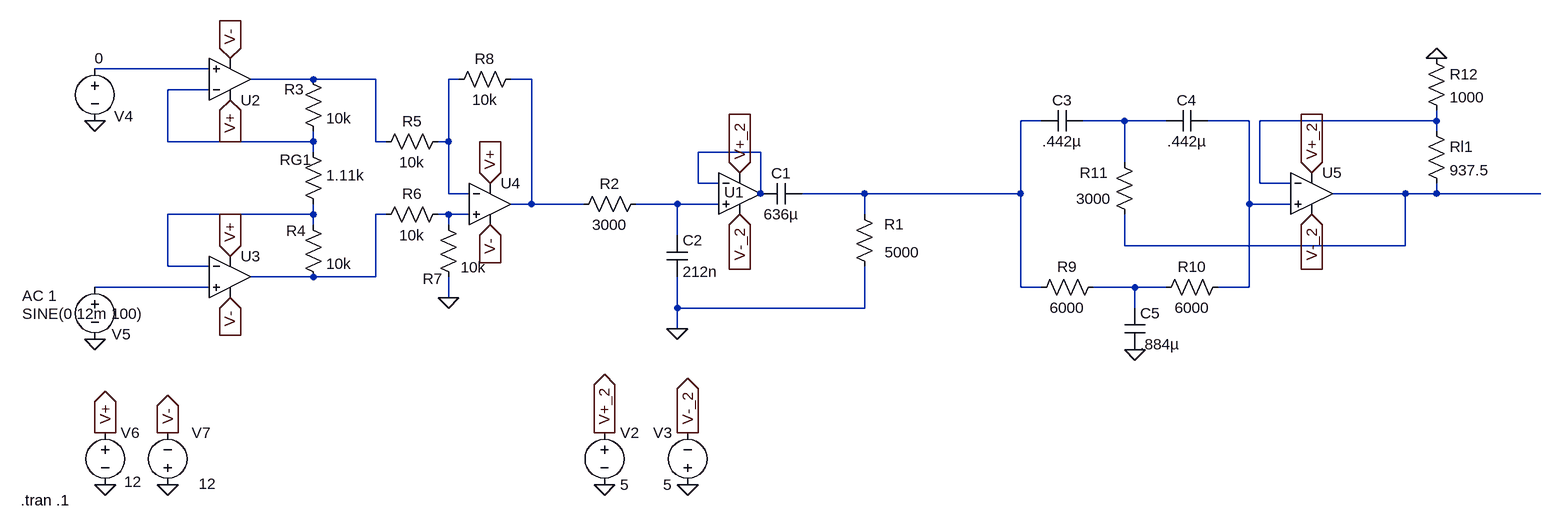
[diagram p0: schematic Full Circuit fr.asc]
Full Circuit fr.asc, the LTspice schematic file:
Version 4
SHEET 1 1400 680
WIRE -848 -64 -1024 -64
WIRE -688 -48 -784 -48
WIRE -592 -48 -688 -48
WIRE -464 -48 -480 -48
WIRE -352 -48 -384 -48
WIRE -848 -32 -912 -32
WIRE 432 16 400 16
WIRE 560 16 496 16
WIRE 624 16 560 16
WIRE 752 16 688 16
WIRE 1040 16 1040 0
WIRE 1040 16 768 16
WIRE 1040 32 1040 16
WIRE -912 48 -912 -32
WIRE -688 48 -688 32
WIRE -688 48 -912 48
WIRE -592 48 -592 -48
WIRE -576 48 -592 48
WIRE -480 48 -480 -48
WIRE -480 48 -496 48
WIRE -688 64 -688 48
WIRE 0 64 -96 64
WIRE 560 80 560 16
WIRE -96 112 -96 64
WIRE -64 112 -96 112
WIRE 768 112 768 16
WIRE 816 112 768 112
WIRE -480 128 -480 48
WIRE -448 128 -480 128
WIRE 0 128 0 64
WIRE 160 128 64 128
WIRE 400 128 400 16
WIRE 400 128 160 128
WIRE 992 128 880 128
WIRE 1040 128 1040 112
WIRE 1040 128 992 128
WIRE 1200 128 1040 128
WIRE -352 144 -352 -48
WIRE -352 144 -384 144
WIRE -272 144 -352 144
WIRE -128 144 -192 144
WIRE -64 144 -128 144
WIRE 752 144 752 16
WIRE 816 144 752 144
WIRE -688 160 -688 144
WIRE -688 160 -912 160
WIRE -576 160 -592 160
WIRE -480 160 -496 160
WIRE -448 160 -480 160
WIRE 160 160 160 128
WIRE -688 176 -688 160
WIRE -480 176 -480 160
WIRE -128 192 -128 144
WIRE 560 208 560 160
WIRE 992 208 992 128
WIRE 992 208 560 208
WIRE -912 240 -912 160
WIRE -848 240 -912 240
WIRE -688 256 -784 256
WIRE -592 256 -592 160
WIRE -592 256 -688 256
WIRE -848 272 -1024 272
WIRE 400 272 400 128
WIRE 432 272 400 272
WIRE 576 272 512 272
WIRE 624 272 576 272
WIRE 752 272 752 144
WIRE 752 272 704 272
WIRE -480 288 -480 256
WIRE -128 304 -128 256
WIRE 160 304 160 240
WIRE 160 304 -128 304
WIRE 576 304 576 272
WIRE -128 336 -128 304
FLAG -128 336 0
FLAG -240 496 V+_2
IOPIN -240 496 Out
FLAG -112 496 V-_2
IOPIN -112 496 Out
FLAG -240 576 0
FLAG -112 576 0
FLAG -32 96 V+_2
IOPIN -32 96 In
FLAG -32 160 V-_2
IOPIN -32 160 In
FLAG -480 288 0
FLAG -1024 16 0
FLAG -1024 352 0
FLAG -816 -80 V-
IOPIN -816 -80 In
FLAG -816 -16 V+
IOPIN -816 -16 In
FLAG -816 224 V+
IOPIN -816 224 In
FLAG -816 288 V-
IOPIN -816 288 In
FLAG -416 112 V+
IOPIN -416 112 In
FLAG -416 176 V-
IOPIN -416 176 In
FLAG -1008 576 0
FLAG -912 576 0
FLAG -1008 496 V+
IOPIN -1008 496 Out
FLAG -912 496 V-
IOPIN -912 496 Out
FLAG 848 96 V+_2
IOPIN 848 96 In
FLAG 848 160 V-_2
IOPIN 848 160 In
FLAG 576 368 0
FLAG 1040 -80 0
SYMBOL cap 0 144 R270
WINDOW 0 32 32 VTop 2
WINDOW 3 0 32 VBottom 2
SYMATTR InstName C1
SYMATTR Value 636µ
SYMBOL cap -144 192 R0
SYMATTR InstName C2
SYMATTR Value 212n
SYMBOL res 176 256 R180
WINDOW 0 -45 81 Left 2
WINDOW 3 -69 38 Left 2
SYMATTR InstName R1
SYMATTR Value 5000
SYMBOL res -288 160 R270
WINDOW 0 32 56 VTop 2
WINDOW 3 0 56 VBottom 2
SYMATTR InstName R2
SYMATTR Value 3000
SYMBOL OpAmps\\UniversalOpamp2 -32 128 R0
WINDOW 0 -24 -2 Left 2
SYMATTR InstName U1
SYMBOL voltage -240 480 R0
WINDOW 123 0 0 Left 0
WINDOW 39 0 0 Left 0
SYMATTR InstName V2
SYMATTR Value 5
SYMBOL voltage -112 592 R180
WINDOW 0 24 96 Left 2
WINDOW 3 24 16 Left 2
WINDOW 123 0 0 Left 0
WINDOW 39 0 0 Left 0
SYMATTR InstName V3
SYMATTR Value 5
SYMBOL OpAmps\\UniversalOpamp2 -816 -48 M180
SYMATTR InstName U2
SYMBOL OpAmps\\UniversalOpamp2 -816 256 R0
SYMATTR InstName U3
SYMBOL res -704 -64 R0
WINDOW 0 -29 31 Left 2
SYMATTR InstName R3
SYMATTR Value 10k
SYMBOL res -704 48 R0
WINDOW 0 -36 28 Left 2
WINDOW 3 36 52 Left 2
SYMATTR InstName RG1
SYMATTR Value 1.11k
SYMBOL res -704 160 R0
WINDOW 0 -26 25 Left 2
SYMATTR InstName R4
SYMATTR Value 10k
SYMBOL OpAmps\\UniversalOpamp2 -416 144 R0
SYMATTR InstName U4
SYMBOL res -480 32 R90
WINDOW 0 0 56 VBottom 2
WINDOW 3 32 56 VTop 2
SYMATTR InstName R5
SYMATTR Value 10k
SYMBOL res -480 144 R90
WINDOW 0 0 56 VBottom 2
WINDOW 3 32 56 VTop 2
SYMATTR InstName R6
SYMATTR Value 10k
SYMBOL res -496 160 R0
WINDOW 0 -24 99 Left 2
WINDOW 3 35 81 Left 2
SYMATTR InstName R7
SYMATTR Value 10k
SYMBOL res -368 -64 R90
WINDOW 0 0 56 VBottom 2
WINDOW 3 32 56 VTop 2
SYMATTR InstName R8
SYMATTR Value 10k
SYMBOL voltage -1024 -80 R0
WINDOW 0 30 89 Left 2
WINDOW 3 0 0 Left 2
WINDOW 123 0 0 Left 0
WINDOW 39 0 0 Left 0
SYMATTR InstName V4
SYMATTR Value 0
SYMBOL voltage -1024 256 R0
WINDOW 0 26 88 Left 2
WINDOW 3 -112 57 Left 2
WINDOW 123 -112 29 Left 2
WINDOW 39 0 0 Left 0
SYMATTR InstName V5
SYMATTR Value SINE(0 12m 100)
SYMATTR Value2 AC 1
SYMBOL voltage -1008 480 R0
WINDOW 3 29 91 Left 2
WINDOW 123 0 0 Left 0
WINDOW 39 0 0 Left 0
SYMATTR Value 12
SYMATTR InstName V6
SYMBOL voltage -912 592 R180
WINDOW 0 -66 96 Left 2
WINDOW 3 -75 18 Left 2
WINDOW 123 0 0 Left 0
WINDOW 39 0 0 Left 0
SYMATTR InstName V7
SYMATTR Value 12
SYMBOL res 528 256 R90
WINDOW 0 0 56 VBottom 2
WINDOW 3 32 56 VTop 2
SYMATTR InstName R9
SYMATTR Value 6000
SYMBOL res 720 256 R90
WINDOW 0 0 56 VBottom 2
WINDOW 3 32 56 VTop 2
SYMATTR InstName R10
SYMATTR Value 6000
SYMBOL cap 496 0 R90
WINDOW 0 0 32 VBottom 2
WINDOW 3 32 32 VTop 2
SYMATTR InstName C3
SYMATTR Value .442µ
SYMBOL cap 688 0 R90
WINDOW 0 0 32 VBottom 2
WINDOW 3 32 32 VTop 2
SYMATTR InstName C4
SYMATTR Value .442µ
SYMBOL res 576 176 R180
WINDOW 0 41 80 Left 2
WINDOW 3 36 40 Left 2
SYMATTR InstName R11
SYMATTR Value 3000
SYMBOL OpAmps\\UniversalOpamp2 848 128 R0
SYMATTR InstName U5
SYMBOL cap 560 304 R0
SYMATTR InstName C5
SYMATTR Value .884µ
SYMBOL res 1024 -96 R0
SYMATTR InstName R12
SYMATTR Value 1000
SYMBOL res 1024 16 R0
SYMATTR InstName Rl1
SYMATTR Value 937.5
TEXT -1138 600 Left 2 !.tran .1

The netlist it stands for:
* Full Circuit fr.asc
C1 N010 N006 636µ
C2 N012 0 212n
R1 0 N006 5000
R2 N004 N012 3000
XU1 N012 N010 V+_2 V-_2 N010 level.2 Avol=1Meg GBW=10Meg Slew=10Meg ilimit=25m rail=0 Vos=0 phimargin=45 en=0 enk=0 in=0 ink=0 Rin=500Meg  ; pins IN+ IN- V+ V- OUT
V2 V+_2 0 5
V3 0 V-_2 5
XU2 N001 N005 V+ V- N002 level.2 Avol=1Meg GBW=10Meg Slew=10Meg ilimit=25m rail=0 Vos=0 phimargin=45 en=0 enk=0 in=0 ink=0 Rin=500Meg  ; pins IN+ IN- V+ V- OUT
XU3 N016 N013 V+ V- N014 level.2 Avol=1Meg GBW=10Meg Slew=10Meg ilimit=25m rail=0 Vos=0 phimargin=45 en=0 enk=0 in=0 ink=0 Rin=500Meg  ; pins IN+ IN- V+ V- OUT
R3 N002 N005 10k
RG1 N005 N013 1.11k
R4 N013 N014 10k
XU4 N015 N003 V+ V- N004 level.2 Avol=1Meg GBW=10Meg Slew=10Meg ilimit=25m rail=0 Vos=0 phimargin=45 en=0 enk=0 in=0 ink=0 Rin=500Meg  ; pins IN+ IN- V+ V- OUT
R5 N003 N002 10k
R6 N015 N014 10k
R7 N015 0 10k
R8 N004 N003 10k
V4 N001 0 0
V5 N016 0 SINE(0 12m 100) AC 1
V6 V+ 0 12
V7 0 V- 12
R9 N017 N006 6000
R10 N008 N017 6000
C3 N007 N006 .442µ
C4 N008 N007 .442µ
R11 N011 N007 3000
XU5 N008 N009 V+_2 V-_2 N011 level.2 Avol=1Meg GBW=10Meg Slew=10Meg ilimit=25m rail=0 Vos=0 phimargin=45 en=0 enk=0 in=0 ink=0 Rin=500Meg  ; pins IN+ IN- V+ V- OUT
C5 N017 0 .884µ
R12 0 N009 1000
Rl1 N009 N011 937.5
.tran .1
.lib UniversalOpamps2.sub
.backanno
.end